# Altium schematic sheet Схема принципиальная111.SchDoc
size 594 x 420 mm; Scale: 1:1; Разраб.: Гончаренко В.Ю.; Пров.: Смолин В.А.; Номер листа: 1; Общее количество листов: 1; Наименование изделия 1: Цифровой автомат; Наименование изделия 2: Схема электрическая; Наименование изделия 3: принципиальная; Нач. отд.: Нач. отд.; Децимальный номер: СФ МЭИ КР ПЭ2-18 11.03.04 03 Э3; Наименование. Строка 2: Автомат; Наименование. Строка 3: Схема электирическая принципиальная; Наименование. Строка 1: Циффровой; Разработал: Гончаренко В.Ю.; Проверил: Смолин В.А.; Утвердил: Рассказа Д.С.; Литера: У; Масштаб: 1:1; Лист. Номер: 1; Лист. Всего: 1
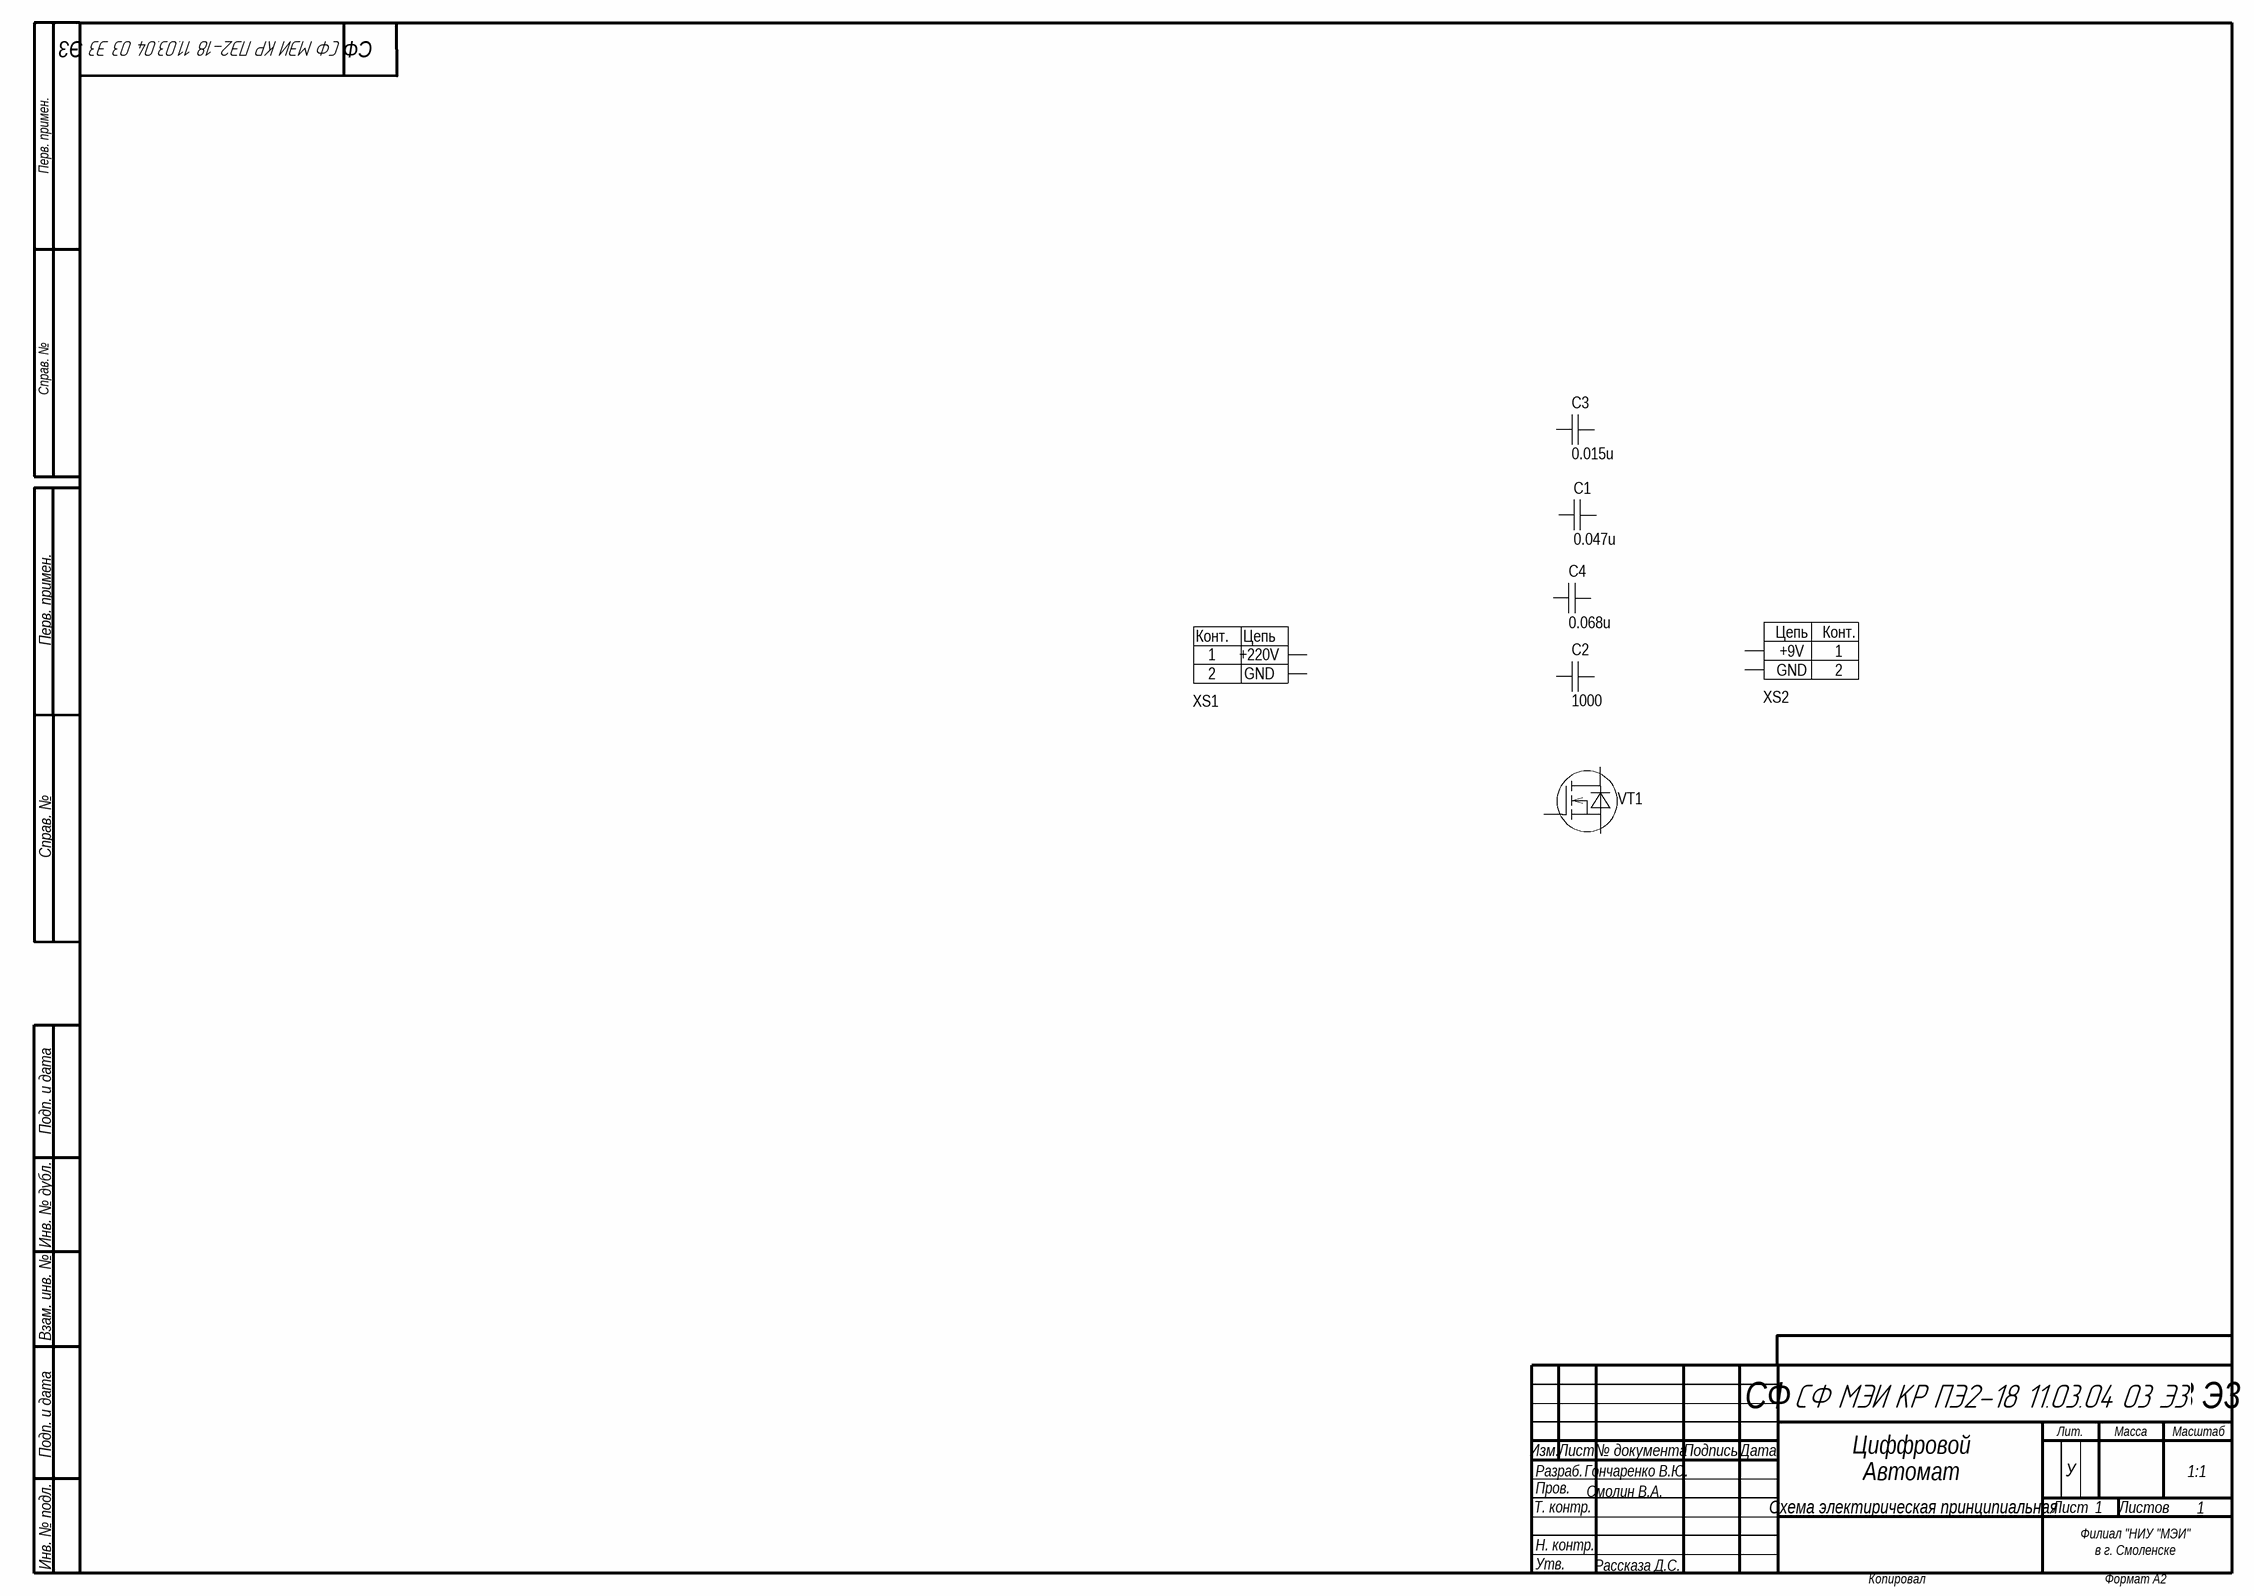
[diagram p0: Схема принципиальная111.SchDoc]

## Parts
C1  0.047u  [0805]
C2  1000  [0805]
C3  0.015u  [0805]
C4  0.068u  [0805]
VT1  IRLML2402TRPBF  [SOT23]  (value not drawn)
XS1  XS 2 pin 220 B  [DG126-5.0-02P]  (value not drawn)
XS2  XS 2 pin 9v  [DG126-5.0-02P]  (value not drawn)

## Nets

Not connected (* = marked no-connect by the designer): C1 1 2; C2 1 2; C3 1 2; C4 1 2; VT1 1(G) 2(S) 3(D); XS1 1(Pin1) 2(Pin2); XS2 1(Pin1) 2(Pin2)

## Notes on the sheet
- Перв. примен.
- Справ. №
- Филиал "НИУ "МЭИ"
  в г. Смоленске
  ПЭ2-18
- Разработал. Дата
- Подп. и дата
- Инв. № дубл.
- Взам. инв. №
- Разраб.
- Изм.
- Лист
- № документа
- Подпись
- Дата
- Лит.
- Масса
- Масштаб
- Т. контр.
- Пров.
- Листов
- Инв. № подл.
- Н. контр.
- Утв.
- Копировал
- Формат A2
- (in symbol XS 2 pin 9v) Цепь; Конт.; +9V; GND
- (in symbol XS 2 pin 220 B) Конт.; Цепь; +220V; GND

## Library data of the parts
C1 = К53-68"R"-25В-0.047 мкФ ±10% 0805_3: К53-68"R"-25В-0.047 мкФ ±10%
C2 = К53-68"R"-25В-1000 пФ ±10% 0805_2: К53-68"R"-25В-1000 пФ ±10%
C3 = К53-68"R"-25В-0.015 мкФ ±10% 0805_1: К53-68"R"-25В-0.015 мкФ ±10%
C4 = К53-68"R"-25В-0.068 мкФ ±10% 0805: К53-68"R"-25В-0.068 мкФ ±10%
VT1 = IRLML2402TRPBF: SI2304DDS-T1-GE3